# Altium schematic sheet Sheet3.SchDoc
size A4
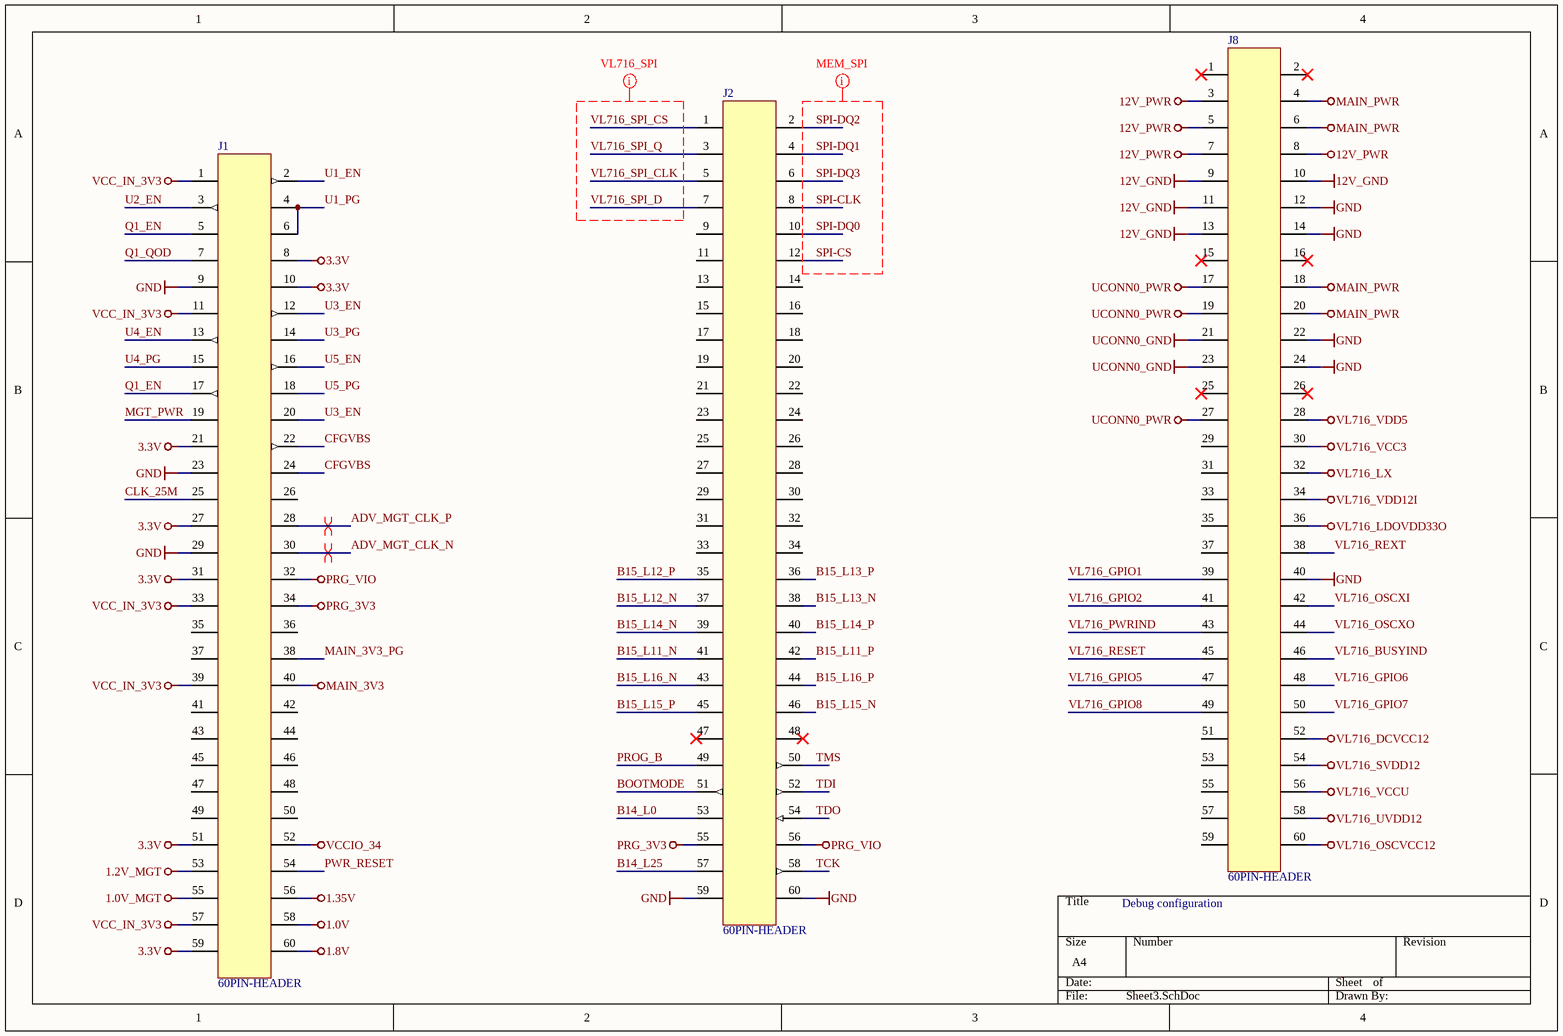
[diagram p0: Sheet3.SchDoc]

## Parts
J1  60PIN-HEADER  [60PIN-HEADER]
J2  60PIN-HEADER  [60PIN-HEADER]
J8  60PIN-HEADER  [60PIN-HEADER]

## Nets
1.0V: J1.58
1.0V_MGT: J1.55
1.2V_MGT: J1.53
1.8V: J1.60
1.35V: J1.56
3.3V: J1.8 J1.10 J1.21 J1.27 J1.31 J1.51 J1.59
12V_GND: J8.9 J8.10 J8.11 J8.13
12V_PWR: J8.3 J8.5 J8.7 J8.8
GND: J1.9 J1.23 J1.29 J2.59 J2.60 J8.12 J8.14 J8.22 J8.24 J8.40
MAIN_3V3: J1.40
MAIN_PWR: J8.4 J8.6 J8.18 J8.20
PRG_3V3: J1.34 J2.55
PRG_VIO: J1.32 J2.56
UCONN0_GND: J8.21 J8.23
UCONN0_PWR: J8.17 J8.19 J8.27
VCC_IN_3V3: J1.1 J1.11 J1.33 J1.39 J1.57
VCCIO_34: J1.52
VL716_DCVCC12: J8.52
VL716_LDOVDD33O: J8.36
VL716_LX: J8.32
VL716_OSCVCC12: J8.60
VL716_SVDD12: J8.54
VL716_UVDD12: J8.58
VL716_VCC3: J8.30
VL716_VCCU: J8.56
VL716_VDD5: J8.28
VL716_VDD12I: J8.34
ADV_MGT_CLK_N: J1.30
ADV_MGT_CLK_P: J1.28
B14_L0: J2.53
B14_L25: J2.57
B15_L11_N: J2.41
B15_L11_P: J2.42
B15_L12_N: J2.37
B15_L12_P: J2.35
B15_L13_N: J2.38
B15_L13_P: J2.36
B15_L14_N: J2.39
B15_L14_P: J2.40
B15_L15_N: J2.46
B15_L15_P: J2.45
B15_L16_N: J2.43
B15_L16_P: J2.44
BOOTMODE: J2.51
CFGVBS: J1.22 J1.24
CLK_25M: J1.25
MAIN_3V3_PG: J1.38
MGT_PWR: J1.19
PROG_B: J2.49
PWR_RESET: J1.54
Q1_EN: J1.5 J1.17
Q1_QOD: J1.7
SPI-CLK: J2.8
SPI-CS: J2.12
SPI-DQ0: J2.10
SPI-DQ1: J2.4
SPI-DQ2: J2.2
SPI-DQ3: J2.6
TCK: J2.58
TDI: J2.52
TDO: J2.54
TMS: J2.50
U1_EN: J1.2
U1_PG: J1.4 J1.6
U2_EN: J1.3
U3_EN: J1.12 J1.20
U3_PG: J1.14
U4_EN: J1.13
U4_PG: J1.15
U5_EN: J1.16
U5_PG: J1.18
VL716_BUSYIND: J8.46
VL716_GPIO1: J8.39
VL716_GPIO2: J8.41
VL716_GPIO5: J8.47
VL716_GPIO6: J8.48
VL716_GPIO7: J8.50
VL716_GPIO8: J8.49
VL716_OSCXI: J8.42
VL716_OSCXO: J8.44
VL716_PWRIND: J8.43
VL716_RESET: J8.45
VL716_REXT: J8.38
VL716_SPI_CLK: J2.5
VL716_SPI_CS: J2.1
VL716_SPI_D: J2.7
VL716_SPI_Q: J2.3

Not connected (* = marked no-connect by the designer): J1 26 35 36 37 41 42 43 44 45 46 47 48 49 50; J2 9 11 13 14 15 16 17 18 19 20 21 22 23 24 25 26 27 28 29 30 31 32 33 34 47* 48*; J8 1* 2* 15* 16* 25* 26* 29 31 33 35 37 51 53 55 57 59

## Layout directives
differential pair: ADV_MGT_CLK_N, ADV_MGT_CLK_P
net class VL716_SPI: VL716_SPI_CLK, VL716_SPI_CS, VL716_SPI_D, VL716_SPI_Q
net class MEM_SPI: SPI-CLK, SPI-CS, SPI-DQ0, SPI-DQ1, SPI-DQ2, SPI-DQ3

## Notes on the sheet
- (near J8) Debug configuration

## Library data of the parts
J1 J2 J8 = 60PIN-HEADER: 2.54mm 60-pin header